# EAGLE design Shakey (EAGLE 6.5.0)
AUTHOR: Little Bird Electronics; PRODUCT_NAME: Shakey; REV: 1.1
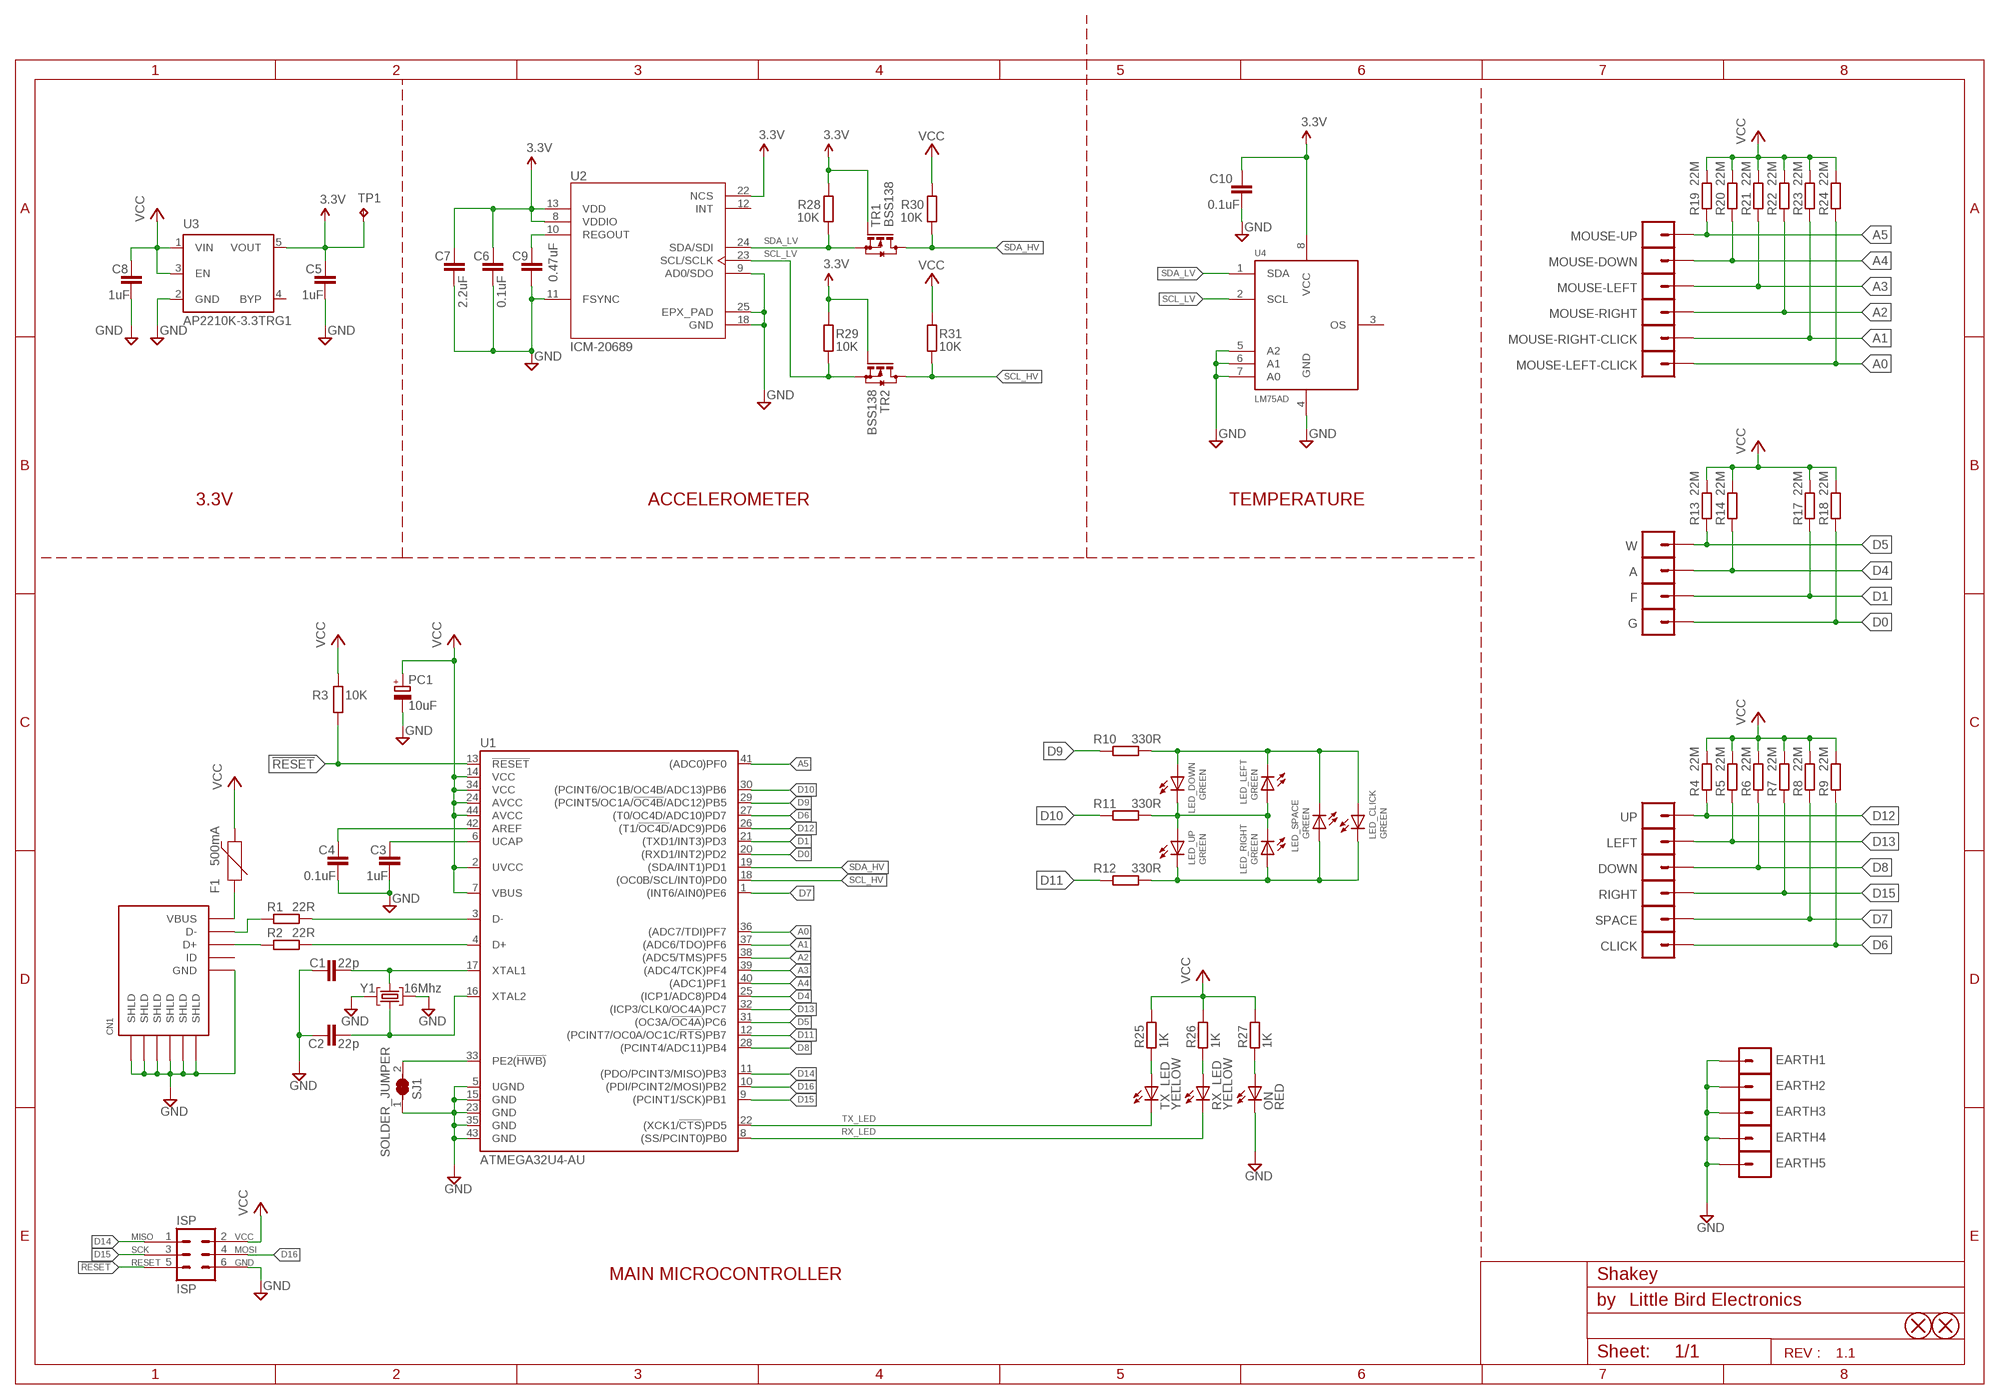
[diagram p0: schematic, sheet 1]

## Parts
A  MA01-1-ALLIGATOR-3.0MM  [MA01-1-ALLIGATOR-3.0MM]
C1  22p  C-EUC0603  [C0603]
C2  22p  C-EUC0603  [C0603]
C3  1uF  C-EUC0603  [C0603]
C4  0.1uF  C-EUC0603  [C0603]
C5  1uF  C-EUC0603  [C0603]
C6  0.1uF  C-EUC0603  [C0603]
C7  2.2uF  C-EUC0603  [C0603]
C8  1uF  C-EUC0603  [C0603]
C9  0.47uF  C-EUC0603  [C0603]
C10  0.1uF  C-EUC0603  [C0603]
CLICK  MA01-1-ALLIGATOR-3.0MM  [MA01-1-ALLIGATOR-3.0MM]
CN1  MicroUSB  CONN_USB-4UCON-11071  [4UCON-11071]
DOWN  MA01-1-ALLIGATOR-3.0MM  [MA01-1-ALLIGATOR-3.0MM]
EARTH1  MA01-1-ALLIGATOR-3.0MM  [MA01-1-ALLIGATOR-3.0MM]
EARTH2  MA01-1-ALLIGATOR-3.0MM  [MA01-1-ALLIGATOR-3.0MM]
EARTH3  MA01-1-ALLIGATOR-3.0MM  [MA01-1-ALLIGATOR-3.0MM]
EARTH4  MA01-1-ALLIGATOR-3.0MM  [MA01-1-ALLIGATOR-3.0MM]
EARTH5  MA01-1-ALLIGATOR-3.0MM  [MA01-1-ALLIGATOR-3.0MM]
F  MA01-1-ALLIGATOR-3.0MM  [MA01-1-ALLIGATOR-3.0MM]
F1  500mA  PPTC-1206  [PPC-1206]
G  MA01-1-ALLIGATOR-3.0MM  [MA01-1-ALLIGATOR-3.0MM]
ISP  ISP  DEBUGPORT-6PIN-ISP-AVR  [MA03-2]
JP1  FIDUCIAL-1X3MM  [FIDUCIAL-1X3MM]
JP2  FIDUCIAL-1X3MM  [FIDUCIAL-1X3MM]
LED_CLICK  GREEN  LED-1206-LTST-BOTTOM  [LED-1206-LTST-BOTTOM]
LED_DOWN  GREEN  LED-1206-LTST-BOTTOM  [LED-1206-LTST-BOTTOM]
LED_LEFT  GREEN  LED-1206-LTST-BOTTOM  [LED-1206-LTST-BOTTOM]
LED_RIGHT  GREEN  LED-1206-LTST-BOTTOM  [LED-1206-LTST-BOTTOM]
LED_SPACE  GREEN  LED-1206-LTST-BOTTOM  [LED-1206-LTST-BOTTOM]
LED_UP  GREEN  LED-1206-LTST-BOTTOM  [LED-1206-LTST-BOTTOM]
LEFT  MA01-1-ALLIGATOR-3.0MM  [MA01-1-ALLIGATOR-3.0MM]
MOUSE-DOWN  MA01-1-ALLIGATOR-3.0MM  [MA01-1-ALLIGATOR-3.0MM]
MOUSE-LEFT  MA01-1-ALLIGATOR-3.0MM  [MA01-1-ALLIGATOR-3.0MM]
MOUSE-LEFT-CLICK  MA01-1-ALLIGATOR-3.0MM  [MA01-1-ALLIGATOR-3.0MM]
MOUSE-RIGHT  MA01-1-ALLIGATOR-3.0MM  [MA01-1-ALLIGATOR-3.0MM]
MOUSE-RIGHT-CLICK  MA01-1-ALLIGATOR-3.0MM  [MA01-1-ALLIGATOR-3.0MM]
MOUSE-UP  MA01-1-ALLIGATOR-3.0MM  [MA01-1-ALLIGATOR-3.0MM]
ON  RED  LED-1206-LTST-BOTTOM  [LED-1206-LTST-BOTTOM]
PC1  10uF  CAP_POL-CT6032  [CT6032]
R1  22R  R-EU_R0603  [R0603]
R2  22R  R-EU_R0603  [R0603]
R3  10K  R-EU_R0603  [R0603]
R4  22M  R-EU_R0603  [R0603]
R5  22M  R-EU_R0603  [R0603]
R6  22M  R-EU_R0603  [R0603]
R7  22M  R-EU_R0603  [R0603]
R8  22M  R-EU_R0603  [R0603]
R9  22M  R-EU_R0603  [R0603]
R10  330R  R-EU_R0603  [R0603]
R11  330R  R-EU_R0603  [R0603]
R12  330R  R-EU_R0603  [R0603]
R13  22M  R-EU_R0603  [R0603]
R14  22M  R-EU_R0603  [R0603]
R17  22M  R-EU_R0603  [R0603]
R18  22M  R-EU_R0603  [R0603]
R19  22M  R-EU_R0603  [R0603]
R20  22M  R-EU_R0603  [R0603]
R21  22M  R-EU_R0603  [R0603]
R22  22M  R-EU_R0603  [R0603]
R23  22M  R-EU_R0603  [R0603]
R24  22M  R-EU_R0603  [R0603]
R25  1K  R-EU_R0603  [R0603]
R26  1K  R-EU_R0603  [R0603]
R27  1K  R-EU_R0603  [R0603]
R28  10K  R-EU_R0603  [R0603]
R29  10K  R-EU_R0603  [R0603]
R30  10K  R-EU_R0603  [R0603]
R31  10K  R-EU_R0603  [R0603]
RIGHT  MA01-1-ALLIGATOR-3.0MM  [MA01-1-ALLIGATOR-3.0MM]
RX_LED  YELLOW  LED-1206-LTST-BOTTOM  [LED-1206-LTST-BOTTOM]
SJ1  SOLDER_JUMPER  SOLDER_JUMPER_NC  [SOLDER_JUMPER_NC]
SPACE  MA01-1-ALLIGATOR-3.0MM  [MA01-1-ALLIGATOR-3.0MM]
TP1  TESTPAD  TESTPAD-2.54MM  [TP-2.54MM]
TR1  BSS138  MOSFET-N-BSS138  [SOT23]
TR2  BSS138  MOSFET-N-BSS138  [SOT23]
TX_LED  YELLOW  LED-1206-LTST-BOTTOM  [LED-1206-LTST-BOTTOM]
U1  ATMEGA32U4-AU  [TQFP44]
U2  ICM-20689  [QFN-24-4X4-0.9MM]
U3  AP2210K-3.3TRG1  [SOT23-5]
U4  LM75AD  [SOT96-1]
UP  MA01-1-ALLIGATOR-3.0MM  [MA01-1-ALLIGATOR-3.0MM]
W  MA01-1-ALLIGATOR-3.0MM  [MA01-1-ALLIGATOR-3.0MM]
Y1  16Mhz  CRYSTAL_GROUNDED_2GND-FA-238  [FA-238]

## Nets
3.3V: C5.2 C6.2 C7.2 C10.2 R28.2 R29.2 TP1.TP TR1.1(G) TR2.1(G) U2.8(VDDIO) U2.13(VDD) U2.22(NCS) U3.5(VOUT) U4.8(VCC)
!RESET!: ISP.5 R3.1 U1.13(!RESET)
A0: MOUSE-LEFT-CLICK.1@0 MOUSE-LEFT-CLICK.1@1 R24.1 U1.36((ADC7/TDI)PF7)
A1: MOUSE-RIGHT-CLICK.1@0 MOUSE-RIGHT-CLICK.1@1 R23.1 U1.37((ADC6/TDO)PF6)
A2: MOUSE-RIGHT.1@0 MOUSE-RIGHT.1@1 R22.1 U1.38((ADC5/TMS)PF5)
A3: MOUSE-LEFT.1@0 MOUSE-LEFT.1@1 R21.1 U1.39((ADC4/TCK)PF4)
A4: MOUSE-DOWN.1@0 MOUSE-DOWN.1@1 R20.1 U1.40((ADC1)PF1)
A5: MOUSE-UP.1@0 MOUSE-UP.1@1 R19.1 U1.41((ADC0)PF0)
D0: G.1@0 G.1@1 R18.1 U1.20((RXD1/INT2)PD2)
D1: F.1@0 F.1@1 R17.1 U1.21((TXD1/INT3)PD3)
D4: A.1@0 A.1@1 R14.1 U1.25((ICP1/ADC8)PD4)
D5: R13.1 U1.31((OC3A/!OC4A!)PC6) W.1@0 W.1@1
D6: CLICK.1@0 CLICK.1@1 R9.1 U1.27((T0/OC4D/ADC10)PD7)
D7: R8.1 SPACE.1@0 SPACE.1@1 U1.1((INT6/AIN0)PE6)
D8: DOWN.1@0 DOWN.1@1 R6.1 U1.28((PCINT4/ADC11)PB4)
D9: R10.1 U1.29((PCINT5/OC1A/!OC4B!/ADC12)PB5)
D10: R11.1 U1.30((PCINT6/OC1B/OC4B/ADC13)PB6)
D11: R12.1 U1.12((PCINT7/OC0A/OC1C/!RTS!)PB7)
D12: R4.1 U1.26((T1/!OC4D!/ADC9)PD6) UP.1@0 UP.1@1
D13: LEFT.1@0 LEFT.1@1 R5.1 U1.32((ICP3/CLK0/OC4A)PC7)
D14: ISP.1 U1.11((PDO/PCINT3/MISO)PB3)
D15: ISP.3 R7.1 RIGHT.1@0 RIGHT.1@1 U1.9((PCINT1/SCK)PB1)
D16: ISP.4 U1.10((PDI/PCINT2/MOSI)PB2)
GND: C1.1 C2.1 C3.1 C4.1 C5.1 C6.1 C7.1 C8.1 C9.1 C10.1 CN1.GND CN1.SHLD@1(SHLD) CN1.SHLD@2(SHLD) CN1.SHLD@3(SHLD) CN1.SHLD@4(SHLD) CN1.SHLD@5(SHLD) CN1.SHLD@6(SHLD) EARTH1.1@0 EARTH1.1@1 EARTH2.1@0 EARTH2.1@1 EARTH3.1@0 EARTH3.1@1 EARTH4.1@0 EARTH4.1@1 EARTH5.1@0 EARTH5.1@1 ISP.6 ON.C PC1.- SJ1.1 U1.5(UGND) U1.15(GND) U1.23(GND) U1.35(GND) U1.43(GND) U2.9(AD0/SDO) U2.11(FSYNC) U2.18(GND) U2.25(EPX_PAD) U3.2(GND) U4.4(GND) U4.5(A2) U4.6(A1) U4.7(A0) Y1.2 Y1.4
HWB: SJ1.2 U1.33(PE2(!HWB))
N$1: C4.2 U1.42(AREF)
N$2: C1.2 U1.17(XTAL1) Y1.1
N$3: C2.2 U1.16(XTAL2) Y1.3
N$4: LED_CLICK.A LED_DOWN.A LED_LEFT.C LED_SPACE.C R10.2
N$5: CN1.VBUS F1.1
N$6: C3.2 U1.6(UCAP)
N$7: CN1.D- R1.1
N$8: R1.2 U1.3(D-)
N$9: R2.2 U1.4(D+)
N$10: CN1.D+ R2.1
N$11: LED_CLICK.C LED_RIGHT.A LED_SPACE.A LED_UP.C R12.2
N$12: LED_DOWN.C LED_LEFT.A LED_RIGHT.C LED_UP.A R11.2
N$13: C9.2 U2.10(REGOUT)
N$17: R25.1 TX_LED.A
N$18: R26.1 RX_LED.A
N$19: ON.A R27.1
RX_LED: RX_LED.C U1.8((SS/PCINT0)PB0)
SCL_HV: R31.1 TR2.3(D) U1.18((OC0B/SCL/INT0)PD0)
SCL_LV: R29.1 TR2.2(S) U2.23(SCL/SCLK) U4.2(SCL)
SDA_HV: R30.1 TR1.3(D) U1.19((SDA/INT1)PD1)
SDA_LV: R28.1 TR1.2(S) U2.24(SDA/SDI) U4.1(SDA)
TX_LED: TX_LED.C U1.22((XCK1/!CTS!)PD5)
VCC: C8.2 F1.2 ISP.2 PC1.+ R3.2 R4.2 R5.2 R6.2 R7.2 R8.2 R9.2 R13.2 R14.2 R17.2 R18.2 R19.2 R20.2 R21.2 R22.2 R23.2 R24.2 R25.2 R26.2 R27.2 R30.2 R31.2 U1.2(UVCC) U1.7(VBUS) U1.14(VCC) U1.24(AVCC) U1.34(VCC) U1.44(AVCC) U3.1(VIN) U3.3(EN)
Unconnected: CN1.ID U2.12(INT) U3.4(BYP) U4.3(OS)

## Notes on the sheet
- 3.3V | ACCELEROMETER | TEMPERATURE
- MAIN MICROCONTROLLER

## Library data of the parts
A CLICK DOWN EARTH1-EARTH5 F G LEFT MOUSE-DOWN MOUSE-LEFT MOUSE-LEFT-CLICK MOUSE-RIGHT MOUSE-RIGHT-CLICK MOUSE-UP RIGHT SPACE UP W = SixthLogic:MA01-1-ALLIGATOR: 2x Holes for Alligator Clips; DESCRIPTION: 2x3mm Holes for Alligator Clips
C1 C2 = rcl:C-EU: CAPACITOR, European symbol; DESCRIPTION: CAP CER 22PF 16V C0G/NP0 0603; MF: KEMET; MPN: C0603C220K4GACTU; OC_DIGIKEY: 399-9031-2-ND; SUPPLIER: Digikey; UNITPRICE: $0.01675; URL: https://www.digikey.com/product-detail/en/kemet/C0603C220K4GACTU/399-9031-2-ND/2200194
C3 C5 C8 = rcl:C-EU: CAPACITOR, European symbol; DESCRIPTION: CAP CER 1UF 25V X5R 0603; MF: Samsung Electro-Mechanics; MPN: CL10A105KA8NNNC; OC_DIGIKEY: 1276-1102-2-ND; SUPPLIER: Digikey; UNITPRICE: $0.00785; URL: https://www.digikey.com/product-detail/en/samsung-electro-mechanics/CL10A105KA8NNNC/1276-1102-2-ND/3886760
C4 C6 C10 = rcl:C-EU: CAPACITOR, European symbol; DESCRIPTION: CAP CER 0.1UF 50V X7R 0603; MF: Samsung Electro-Mechanics; MPN: CL10B104KB8NNNC; OC_DIGIKEY: 1276-1000-2-ND; SUPPLIER: Digikey; UNITPRICE: $0.00652; URL: https://www.digikey.com/product-detail/en/samsung-electro-mechanics/CL10B104KB8NNNC/1276-1000-2-ND/3886658
C7 = rcl:C-EU: CAPACITOR, European symbol; DESCRIPTION: CAP CER 2.2UF 16V X5R 0603; MF: Samsung Electro-Mechanics; MPN: CL10A225KO8NNNC; OC_DIGIKEY: 1276-1040-2-ND; SUPPLIER: Digikey; UNITPRICE: $0.01863; URL: https://www.digikey.com/product-detail/en/samsung-electro-mechanics/CL10A225KO8NNNC/1276-1040-2-ND/3886698
C9 = rcl:C-EU: CAPACITOR, European symbol; DESCRIPTION: CAP CER 0.47UF 16V X7R 0603; MF: Murata Electronics North America; MPN: GCM188R71C474KA55D; OC_DIGIKEY: 490-4775-2-ND; SUPPLIER: Digikey; UNITPRICE: $0.03744; URL: https://www.digikey.com/product-detail/en/murata-electronics-north-america/GCM188R71C474KA55D/490-4775-2-ND/1641649
CN1 = SixthLogic:CONN_USB: USB Connector; DESCRIPTION: B TYPE FEMALE 05P SMT 90° WITHOUT POST 2 SHELL TABS; MF: 4UCON; MPN: 11071; URL: http://www.4uconnector.com/online/Itemadrawing.asp?fldseries=11071&seriesno_a=1006
F1 = SixthLogic:PPTC; DESCRIPTION: PTC RESET FUSE 8V 500MA 1206; MF: Bel Fuse Inc.; MPN: 0ZCJ0050FF2G; OC_DIGIKEY: 507-1802-6-ND; SUPPLIER: Digikey; UNITPRICE: $0.07588; URL: https://www.digikey.com/product-detail/en/bel-fuse-inc/0ZCJ0050FF2G/507-1802-6-ND/4156237
ISP = SixthLogic:DEBUGPORT-6PIN; DESCRIPTION: 6 Pin ISP port
JP1 JP2 = SixthLogic:FIDUCIAL
LED_CLICK LED_DOWN LED_LEFT LED_RIGHT LED_SPACE LED_UP = SixthLogic:LED; DESCRIPTION: LED GREEN CLEAR CHIP SMD; MF: Lite-On Inc.; MPN: LTST-C230KGKT; OC_DIGIKEY: 160-1456-2-ND; SUPPLIER: Digikey; UNITPRICE: $0.05693; URL: https://www.digikey.com/product-detail/en/lite-on-inc/LTST-C230KGKT/160-1456-2-ND/386855
ON = SixthLogic:LED; DESCRIPTION: LED RED CLEAR CHIP SMD; MF: Lite-On Inc.; MPN: LTST-C230KRKT; OC_DIGIKEY: 160-1457-2-ND; SUPPLIER: Digikey; UNITPRICE: $0.05668; URL: https://www.digikey.com/product-detail/en/lite-on-inc/LTST-C230KRKT/160-1457-2-ND/386857
PC1 = SixthLogic:CAP_POL: Capacitor with Polarity; DESCRIPTION: CAP TANT 10UF 20V 10% 2312; MF: KEMET; MPN: T491C106K020AT7280; OC_DIGIKEY: 399-10158-2-ND; SUPPLIER: Digikey; UNITPRICE: $0.15113; URL: https://www.digikey.com/product-detail/en/kemet/T491C106K020AT7280/399-10158-2-ND/3759637
R1 R2 = rcl:R-EU_: RESISTOR, European symbol; DESCRIPTION: RES 22 OHM 5% 1/10W 0603; MF: Stackpole Electronics Inc.; MPN: RMCF0603JT22R0; OC_DIGIKEY: RMCF0603JT22R0TR-ND; SUPPLIER: Digikey; UNITPRICE: $0.00196; URL: https://www.digikey.com/product-detail/en/stackpole-electronics-inc/RMCF0603JT22R0/RMCF0603JT22R0TR-ND/1758012
R3 R28-R31 = rcl:R-EU_: RESISTOR, European symbol; DESCRIPTION: RES 10K OHM 5% 1/10W 0603; MF: Stackpole Electronics Inc.; MPN: RMCF0603JG10K0; OC_DIGIKEY: RMCF0603JG10K0TR-ND; SUPPLIER: Digikey; UNITPRICE: $0.00170; URL: https://www.digikey.com/product-detail/en/stackpole-electronics-inc/RMCF0603JG10K0/RMCF0603JG10K0TR-ND/1712133
R4-R9 R13 R14 R17-R24 = rcl:R-EU_: RESISTOR, European symbol; DESCRIPTION: RES SMD 22M OHM 10% 1/10W 0603; MF: Panasonic Electronic Components; MPN: ERJ-3GEYK226V; OC_DIGIKEY: P22MGTR-ND; SUPPLIER: Digikey; UNITPRICE: $0.00335; URL: https://www.digikey.com/product-detail/en/panasonic-electronic-components/ERJ-3GEYK226V/P22MGTR-ND/282153
R10-R12 = rcl:R-EU_: RESISTOR, European symbol; DESCRIPTION: RES 330 OHM 5% 1/10W 0603; MF: Stackpole Electronics Inc.; MPN: RMCF0603JT330R; OC_DIGIKEY: RMCF0603JT330RTR-ND; SUPPLIER: Digikey; UNITPRICE: $0.00196; URL: https://www.digikey.com/product-detail/en/stackpole-electronics-inc/RMCF0603JT330R/RMCF0603JT330RTR-ND/1757998
R25-R27 = rcl:R-EU_: RESISTOR, European symbol; DESCRIPTION: RES SMD 1K OHM 5% 1/10W 0603; MF: Yageo; MPN: RC0603JR-071KL; OC_DIGIKEY: 311-1.0KGRTR-ND; SUPPLIER: Digikey; UNITPRICE: $0.00268; URL: https://www.digikey.com/product-detail/en/yageo/RC0603JR-071KL/311-1.0KGRTR-ND/726677
RX_LED TX_LED = SixthLogic:LED; DESCRIPTION: LED YELLOW CLEAR CHIP SMD; MF: Lite-On Inc.; MPN: LTST-C230KSKT; OC_DIGIKEY: 160-1458-2-ND; SUPPLIER: Digikey; UNITPRICE: $0.05595; URL: https://www.digikey.com/product-detail/en/lite-on-inc/LTST-C230KSKT/160-1458-2-ND/386859
SJ1 = SixthLogic:SOLDER_JUMPER_NC: Solder Jumper - Normally Closed; DESCRIPTION: Solder Jumper - Normally Closed
TP1 = SixthLogic:TESTPAD
TR1 TR2 = SixthLogic:MOSFET-N; DESCRIPTION: MOSFET N-CH 50V 220MA SOT-23; MF: ON Semiconductor; MPN: BSS138; OC_DIGIKEY: BSS138TR-ND; SUPPLIER: Digikey; UNITPRICE: $0.05419; URL: https://www.digikey.com/product-detail/en/on-semiconductor/BSS138/BSS138TR-ND/244210
U1 = SixthLogic:ATMEGA32U4: Atmel ATmega32u4 MCU, 32KByte Atmel 44-pin 8-bit Microcontroller with 32KBytes of ISP Flash and USB Controller; DESCRIPTION: IC MCU 8BIT 32KB FLASH; MF: Microchip Technology; MPN: ATMEGA32U4-AU; OC_DIGIKEY: ATMEGA32U4-AU-ND; UNITPRICE: $3.04; URL: https://www.digikey.com/product-detail/en/microchip-technology/ATMEGA32U4-AU/ATMEGA32U4-AU-ND/1914602
U2 = SixthLogic:ICM-20689: High Performance 6-Axis MEMS MotionTracking™ Device in 4x4 mm Package The ICM-20689 is a 6-axis MotionTracking device that combines a 3-axis gyroscope, 3-axis accelerometer, and a Digital Motion Processor™ (DMP) in a small 4x4x0.9 mm (24-pin QFN) package.; DESCRIPTION: IMU ACCEL/GYRO/TEMP I2C/SPI QFN; MF: TDK InvenSense; MPN: ICM-20689; OC_DIGIKEY: 1428-1059-2-ND; SUPPLIER: Digikey; UNITPRICE: $2.62548; URL: https://www.digikey.com/product-detail/en/tdk-invensense/ICM-20689/1428-1059-2-ND/5872869
U3 = SixthLogic:AP2210K: The AP2210 is a 300mA ULDO regulator which provides very low noise, ultra low dropout voltage (typically 250mV at 300mA), very low standby current (1μA maximum) and excellent power supply ripple rejection (PSRR 75dB at 100Hz) in battery powered applications, such as handsets, PDAs and in noise sensitive applications, such as RF electronics.; DESCRIPTION: IC REG LDO 3.3V 0.3A SOT23-5; MF: Diodes Inc; MPN: AP2210K-3.3TRG1; OC_DIGIKEY: AP2210K-3.3TRG1DITR-ND; UNITPRICE: $0.10797; URL: https://www.digikey.com/product-detail/en/diodes-incorporated/AP2210K-3.3TRG1/AP2210K-3.3TRG1DITR-ND/4470819
U4 = SixthLogic:LM75: LM75 Digital temperature sensor and thermal watchdog; DESCRIPTION: SENSOR DIGITAL -55C-125C 8SO; MF: NXP USA Inc.; MPN: LM75AD,118; OC_DIGIKEY: 568-10295-2-ND; SUPPLIER: Digikey; UNITPRICE: $0.28743; URL: https://www.digikey.com/product-detail/en/nxp-usa-inc/LM75AD118/568-10295-2-ND/1692795
Y1 = SixthLogic:CRYSTAL_GROUNDED_2GND: 4 PIN SMD Crystal; DESCRIPTION: CRYSTAL 16.0000MHZ 18PF SMD; MF: EPSON; MPN: FA-238 16.0000MB-C3; OC_DIGIKEY: SER3686TR-ND; SUPPLIER: Digikey; UNITPRICE: $0.22880; URL: https://www.digikey.com/product-detail/en/epson/FA-238-16.0000MB-C3/SER3686TR-ND/2403378

## Board
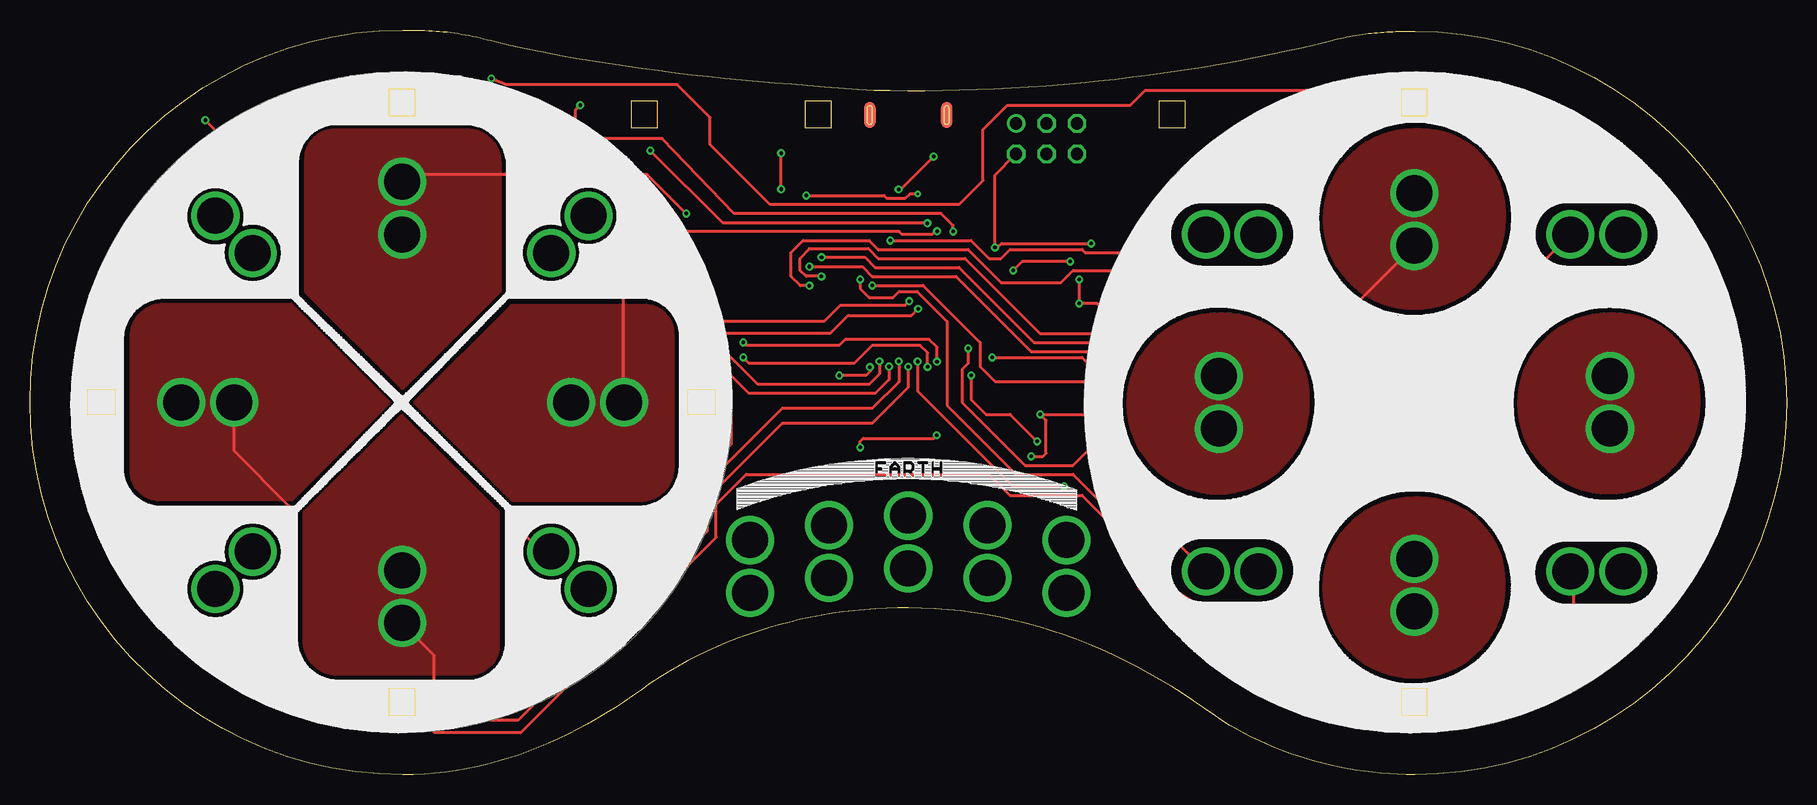
[diagram p1: board, top side]
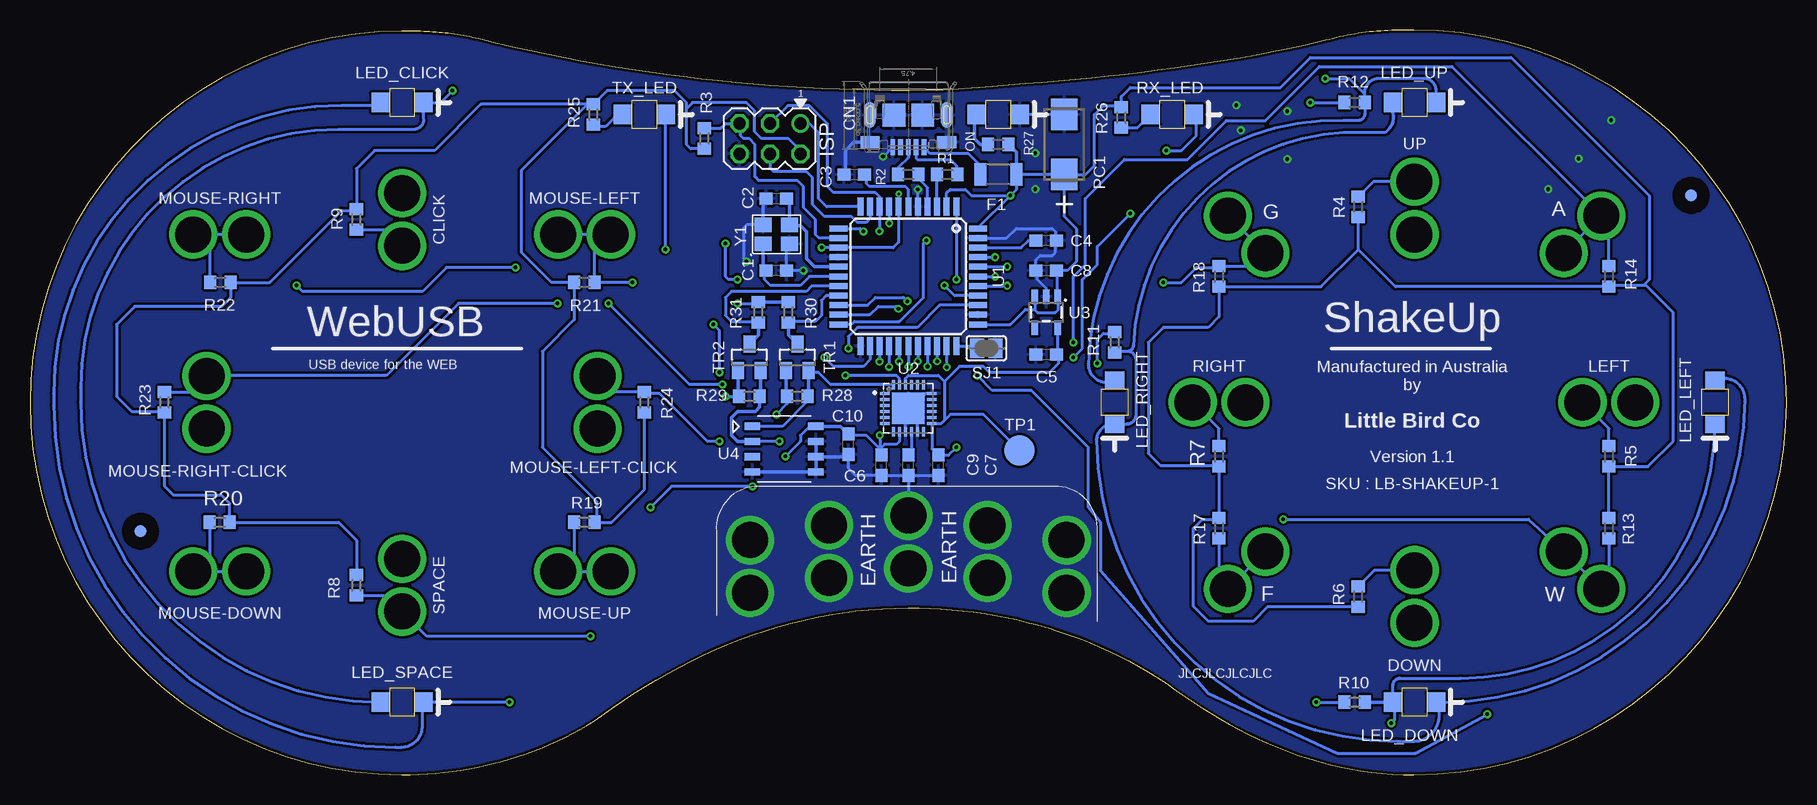
[diagram p2: board, bottom side, seen from below]

Size 146.42 x 62.1 mm. Coordinates in mm from the lower left corner, seen from the top.
Outline: 300 segments
Copper layers (1*16): Top 0.035mm / dielectric 1.5mm / Bottom 0.035mm
Design rules "LBE": minimum track width 7mil, minimum drill 0.2mm, track to track 8mil, track to pad 8mil, pad to pad 8mil, via to via 8mil, smd to smd 8mil, copper to edge 7mil, drill to drill 7mil, minimum pad ring 7mil, minimum via ring 7mil, stop-mask expansion 4mil, vias tented up to drill 25mil, thermal gap 10mil

### Footprints (pad centres in the part's own frame; a part is rotated, then mirrored left to right if it is on the bottom)
MA01-1-ALLIGATOR-3.0MM = drill 3: 1@0 -2.2,0; 1@1 2.2,0
C0603 = smd 1.1 x 1: 1 -0.85,0; 2 0.85,0
4UCON-11071 = smd 0.4 x 1.35: D+ 0,4.125; D- -0.65,4.125; GND 1.3,4.125; ID 0.65,4.125; VBUS -1.3,4.125 | smd 1.9 x 1.9: SHLD@1 -1.2,1.45; SHLD@2 1.2,1.45 | smd 1.6 x 1: SHLD@3 -3.2,3.7; SHLD@4 3.2,3.7 | smd 0.9 x 2.15: SHLD@5 -3.2,1.45; SHLD@6 3.2,1.45 | smd 0.9 x 2.15 bottom: SHLD@7 -3.2,1.45; SHLD@8 3.2,1.45
PPC-1206 = smd 1 x 1.9: 1 -1.5,0; 2 1.5,0
MA03-2 = drill 1.016: 1 -2.54,-1.27 | drill 1.016 octagon: 2 -2.54,1.27; 3 0,-1.27; 4 0,1.27; 5 2.54,-1.27; 6 2.54,1.27
FIDUCIAL-1X3MM = smd 1 x 1: 1 0,0
LED-1206-LTST-BOTTOM = smd 1.6 x 1.5: A 0,-1.805; C 0,1.805
CT6032 = smd 2.2 x 2.6: + 0,-2.5; - 0,2.5
R0603 = smd 1 x 1.1: 1 -0.85,0; 2 0.85,0
SOLDER_JUMPER_NC = smd 1.168 x 1.6: 1 -0.762,0; 2 0.762,0
TP-2.54MM = smd 2.54 x 2.54: TP 0,0
SOT23 = smd 1 x 1.4: 1 -0.95,-1.1; 2 0.95,-1.1; 3 0,1.1
TQFP44 = smd 1.5 x 0.5: 1 -5.8,4; 2 -5.8,3.2; 3 -5.8,2.4; 4 -5.8,1.6; 5 -5.8,0.8; 6 -5.8,0; 7 -5.8,-0.8; 8 -5.8,-1.6; 9 -5.8,-2.4; 10 -5.8,-3.2; 11 -5.8,-4; 23 5.8,-4; 24 5.8,-3.2; 25 5.8,-2.4; 26 5.8,-1.6; 27 5.8,-0.8; 28 5.8,0; 29 5.8,0.8; 30 5.8,1.6; 31 5.8,2.4; 32 5.8,3.2; 33 5.8,4 | smd 0.5 x 1.5: 12 -4,-5.8; 13 -3.2,-5.8; 14 -2.4,-5.8; 15 -1.6,-5.8; 16 -0.8,-5.8; 17 0,-5.8; 18 0.8,-5.8; 19 1.6,-5.8; 20 2.4,-5.8; 21 3.2,-5.8; 22 4,-5.8; 34 4,5.8; 35 3.2,5.8; 36 2.4,5.8; 37 1.6,5.8; 38 0.8,5.8; 39 0,5.8; 40 -0.8,5.8; 41 -1.6,5.8; 42 -2.4,5.8; 43 -3.2,5.8; 44 -4,5.8
QFN-24-4X4-0.9MM = smd 0.79 x 0.26: 1 -1.97,1.25; 2 -1.97,0.75; 3 -1.97,0.25; 4 -1.97,-0.25; 5 -1.97,-0.75; 6 -1.97,-1.25; 13 1.97,-1.25; 14 1.97,-0.75; 15 1.97,-0.25; 16 1.97,0.25; 17 1.97,0.75; 18 1.97,1.25 | smd 0.26 x 0.79: 7 -1.25,-1.97; 8 -0.75,-1.97; 9 -0.25,-1.97; 10 0.25,-1.97; 11 0.75,-1.97; 12 1.25,-1.97; 19 1.25,1.97; 20 0.75,1.97; 21 0.25,1.97; 22 -0.25,1.97; 23 -0.75,1.97; 24 -1.25,1.97 | smd 2.7 x 2.6: 25 0,0
SOT23-5 = smd 0.55 x 1.2: 1 -0.95,-1.3; 2 0,-1.3; 3 0.95,-1.3; 4 0.95,1.3; 5 -0.95,1.3
SOT96-1 = smd 1.3 x 0.6: 1 0,0; 2 0,-1.27; 3 0,-2.54; 4 0,-3.81; 5 5.3,-3.81; 6 5.3,-2.54; 7 5.3,-1.27; 8 5.3,0
FA-238 = smd 1.4 x 1.2: 1 -1.1,-0.8; 2 1.1,-0.8; 3 1.1,0.8; 4 -1.1,0.8

### Placement (x,y rotation side)
A  17.01,45.05 225 bottom
C1  84.21,42.05 180 bottom
C2  84.21,48.05 0 bottom
C3  77.71,50.05 0 bottom
C4  61.71,44.55 180 bottom
C5  61.71,35.05 0 bottom
C6  75.46,25.8 90 bottom
C7  70.71,25.8 90 bottom
C8  61.71,42.05 0 bottom
C9  73.21,25.8 90 bottom
C10  78.21,27.55 90 bottom
CLICK  115.41,46.3 270 bottom
CN1  73.21,56.45 180 bottom
DOWN  31.01,14.85 90 bottom
EARTH1  66.61,18.6 270 bottom
EARTH2  86.41,17.36 270 bottom
EARTH3  79.81,18.6 270 bottom
EARTH4  73.21,19.4 270 bottom
EARTH5  60.01,17.36 270 bottom
F  45.01,17.05 225 bottom
F1  65.71,50.05 0 bottom
G  45.01,45.05 315 bottom
ISP  84.74,53.04 180 bottom
JP1  7.96,48.3 0 bottom
JP2  137.21,20.3 90 bottom
LED_CLICK  115.41,56.05 270 bottom
LED_DOWN  31.01,6.05 270 bottom
LED_LEFT  5.96,31.05 180 bottom
LED_RIGHT  56.01,31.05 180 bottom
LED_SPACE  115.41,6.05 270 bottom
LED_UP  31.01,56.05 270 bottom
LEFT  14.81,31.05 0 bottom
MOUSE-DOWN  130.61,16.95 0 bottom
MOUSE-LEFT  100.21,45.05 180 bottom
MOUSE-LEFT-CLICK  99.11,31.05 270 bottom
MOUSE-RIGHT  130.61,45.05 0 bottom
MOUSE-RIGHT-CLICK  131.71,31.05 270 bottom
MOUSE-UP  100.21,16.95 0 bottom
ON  65.71,55.05 270 bottom
PC1  60.21,52.55 0 bottom
R1  69.96,50.05 180 bottom
R2  73.21,50.05 0 bottom
R3  90.21,53.05 270 bottom
R4  35.71,47.35 270 bottom
R5  14.81,26.55 270 bottom
R6  35.71,14.85 270 bottom
R7  47.31,26.55 270 bottom
R8  119.21,15.8 90 bottom
R9  119.21,46.3 90 bottom
R10  36.01,6.05 0 bottom
R11  56.01,36.05 270 bottom
R12  36.01,56.05 0 bottom
R13  14.81,20.55 90 bottom
R14  14.81,41.55 270 bottom
R17  47.31,20.55 90 bottom
R18  47.31,41.55 270 bottom
R19  100.21,21.05 0 bottom
R20  130.61,21.05 0 bottom
R21  100.21,41.05 180 bottom
R22  130.56,41.05 0 bottom
R23  135.21,31.05 270 bottom
R24  95.21,31.05 270 bottom
R25  99.46,55.05 90 bottom
R26  55.46,54.8 90 bottom
R27  65.71,52.55 0 bottom
R28  82.46,31.55 180 bottom
R29  86.46,31.55 180 bottom
R30  83.21,38.55 90 bottom
R31  85.71,38.55 90 bottom
RIGHT  47.31,31.05 180 bottom
RX_LED  51.21,55.05 270 bottom
SJ1  66.71,35.55 180 bottom
SPACE  115.41,15.8 270 bottom
TP1  63.96,27.05 0 bottom
TR1  82.46,34.8 0 bottom
TR2  86.46,34.8 0 bottom
TX_LED  95.21,55.05 270 bottom
U1  73.21,41.55 270 bottom
U2  73.21,30.55 0 bottom
U3  61.71,38.55 180 bottom
U4  86.21,29.05 0 bottom
UP  31.01,47.25 90 bottom
W  17.01,17.05 315 bottom
Y1  84.21,45.05 0 bottom

### Tracks (layer width: path | path; a pad name or v marks a point on that pad's centre or on a via)
3.3V  (via drill 0.3)
  Top 0.254: v88.46,31.55 88.71,31.3 88.71,30.55 88.21,30.05 v84.21,30.05 84.71,29.55 84.71,26.8 84.46,26.55 v83.46,26.55 | v69.21,27.3 69.21,27.8 69.46,28.05 75.33,28.05 v75.59,28.31
  Bottom 0.254: U2.8 73.96,27.8 74.21,27.55 75.21,27.55 75.46,27.3 | 75.46,27.3 C6.2 | R28.2 83.31,30.95 v84.21,30.05 | v88.46,31.55 R29.2 | U4.8 81.46,29.05 82.21,28.3 82.21,27.8 v83.46,26.55 | 75.46,27.3 75.71,27.3 | 75.71,27.3 76.71,28.3 78.11,28.3 C10.2 | U3.5 60.76,35.15 C5.2 60.71,34.9 60.71,34.3 61.46,33.55 66.46,33.55 66.96,34.05 68.96,34.05 70.21,32.8 | U2.22 73.46,33.05 73.21,33.3 70.71,33.3 70.21,32.8 | 70.21,32.8 70.21,29.55 70.33,29.43 | 70.33,29.43 70.46,29.3 U2.13 71.24,27.18 C7.2 69.86,26.65 v69.21,27.3 | v75.59,28.31 75.59,27.42 75.71,27.3 | TP1.TP 66.96,30.05 69.71,30.05 70.33,29.43
  Bottom 0.305: U4.8 78.86,29.05 C10.2 | TR1.1 83.41,31.65 R28.2 | TR2.1 87.41,31.65 R29.2
!RESET!
  Bottom 0.254: R3.1 88.86,53.9 88.46,54.3 ISP.5 87.21,54.24 87.21,53.3 86.96,53.05 86.46,53.05 86,52.55 86,49.85 85.71,49.55 82.46,49.55 81.96,49.05 81.96,47.3 80.96,46.3 80.96,45.05 80.66,44.75 U1.13
A0  (via drill 0.3)
  Top 0.254: v78.21,35.55 78.21,34.3 77.71,33.8 77.71,31.05 82.96,25.8 86.96,25.8 v88.96,27.8
  Bottom 0.254: MOUSE-LEFT-CLICK.1@0 97.76,31.9 R24.1 95.11,31.8 93.96,31.8 89.96,27.8 v88.96,27.8 | U1.36 70.61,39.15 72.46,37.3 77.46,37.3 78.21,36.55 v78.21,35.55
  pour Top: 91.54,30.94 arc-90 99.04,38.44 99.54,38.44 arc-90 106.54,31.44 106.54,30.94 arc-90 99.04,23.44 arc-90
A1  (via drill 0.3)
  Top 0.254: v70.21,40.8 74.46,40.8 79.21,36.05 79.21,34.05 80.46,32.8 88.46,32.8 v88.71,32.55 | v98.21,39.3 v102.46,39.3
  Bottom 0.254: U1.37 69.36,39.95 v70.21,40.8 | v88.71,32.55 91.46,32.55 v98.21,39.3 | R23.1 133.06,31.9 MOUSE-RIGHT-CLICK.1@0 131.66,33.3 116.71,33.3 110.71,39.3 v102.46,39.3
  pour Top: 124.11,30.96 arc-90 131.61,38.46 132.11,38.46 arc-90 139.11,31.46 139.11,30.96 arc-90 131.61,23.46 arc-90
A2  (via drill 0.3)
  Top 0.254: v64.97,40.78 64.23,40.78 63.46,41.55 63.46,43.55 64.46,44.55 69.96,44.55 70.71,43.8 78.21,43.8 80.96,41.05 85.96,41.05 86.96,42.05 105.71,42.05 v105.96,42.3 | v124.21,40.8 124.21,40.85 MOUSE-RIGHT.1@1
  Bottom 0.254: MOUSE-RIGHT.1@1 MOUSE-RIGHT.1@0 131.41,43.65 R22.1 | U1.38 65,40.75 v64.97,40.78 | v105.96,42.3 111.71,42.3 113.71,40.3 123.71,40.3 v124.21,40.8
A3  (via drill 0.3)
  Top 0.254: v65.97,41.55 v65.96,41.55 65.95,41.56 64.7,41.56 64.21,42.05 64.21,43.05 64.98,43.87 69.89,43.87 70.71,43.05 77.96,43.05 84.21,36.8 91.96,36.8 v96.21,41.05
  Bottom 0.254: MOUSE-LEFT.1@1 MOUSE-LEFT.1@0 99.36,43.7 R21.1 v96.21,41.05 | U1.39 v65.97,41.55
A4  (via drill 0.3)
  Top 0.254: v64.97,42.37 64.97,42.35 69.41,42.35 70.21,41.55 77.21,41.55 83.46,35.3 88.96,35.3 89.96,34.3 89.96,23.8 94.46,19.3 94.46,16.05 112.71,4.05 118.46,4.05 128.71,13.05 128.71,16.65 MOUSE-DOWN.1@1
  Bottom 0.254: R20.1 131.46,18.3 MOUSE-DOWN.1@0 MOUSE-DOWN.1@1 | U1.40 64.99,42.35 v64.97,42.37
A5  (via drill 0.3)
  Top 0.254: v65.98,43.15 v65.99,43.16 69.6,43.16 70.46,42.3 77.46,42.3 83.71,36.05 89.21,36.05 90.71,34.55 90.71,24.25 MOUSE-UP.1@1
  Bottom 0.254: R19.1 101.06,18.3 MOUSE-UP.1@0 MOUSE-UP.1@1 | U1.41 v65.98,43.15
D0  (via drill 0.3)
  Top 0.254: v51.96,41.05 55.21,37.8 66.21,37.8 67.57,39.16 72.96,39.16 v73.29,39.49
  Bottom 0.254: G.1@0 G.1@1 44.55,42.4 R18.1 47.41,42.3 49.21,42.3 50.46,41.05 v51.96,41.05 | U1.20 76.61,39.15 75.96,39.8 73.62,39.8 v73.29,39.49
D1  (via drill 0.3)
  Top 0.254: F.1@0 42.65,18.61 40.71,20.55 40.71,21.55 41.21,22.05 53.46,22.05 54.21,22.8 54.21,35.05 55.96,36.8 66.71,36.8 68.21,38.3 73.48,38.3 v74.03,38.85
  Bottom 0.254: R17.1 47.31,16.24 F.1@1 F.1@0 | U1.21 76.41,38.35 75.71,39.05 74.23,39.05 v74.03,38.85
D4  (via drill 0.3)
  Top 0.254: v75.61,34.44 75.61,35.65 74.96,36.3 67.96,36.3 67.46,35.8 59.71,35.8 v59.46,36.05
  Bottom 0.254: R14.1 14.81,45.96 A.1@0 | A.1@1 A.1@0 | U1.25 v75.61,34.44 | v59.46,36.05 59.46,41.55 58.46,42.55 58.46,48.05 55.21,51.3 49.96,51.3 46.71,54.55 43.46,54.55 38.96,59.05 27.9,59.05 A.1@0
D5  (via drill 0.3)
  Top 0.254: 70.81,34.56 70.8,34.57 v70.81,34.47 70.81,33.4 69.96,32.55 60.71,32.55 58.21,35.05 56.71,35.05 56.21,34.55 56.21,33.8 56.96,33.05 57.46,33.05 58.46,32.05 58.46,27.55 54.96,24.05 54.96,21.05 53.96,20.05 46.46,20.05 44.96,21.3 v41.96,21.3
  Bottom 0.254: R13.1 14.81,16.14 W.1@1 W.1@0 21.51,21.3 v41.96,21.3 | U1.31 v70.81,34.47
D6  (via drill 0.3)
  Top 0.254: v73.99,34.45 v74,34.44 74,32.01 81.96,24.05 v86.21,24.05 | v94.71,22.3 103.96,22.3 108.46,26.8 108.46,37.15 CLICK.1@1
  Bottom 0.254: R9.1 116.76,45.45 CLICK.1@1 | U1.27 73.99,35.73 v73.99,34.45 | v86.21,24.05 92.96,24.05 v94.71,22.3
  pour Top: 107.89,46.33 arc-90 115.39,53.83 115.89,53.83 arc-90 122.89,46.83 122.89,46.33 arc-90 115.39,38.83 arc-90
D7  (via drill 0.3)
  Top 0.254: v69.21,41.3 69.21,40.55 69.96,39.8 71.96,39.8 72.46,40.3 73.96,40.3 76.46,37.8 76.46,30.8 82.21,25.05 86.96,25.05 93.21,18.8 93.21,15.8 v99.71,11.55
  Bottom 0.254: R8.1 116.76,14.95 SPACE.1@1 113.36,11.55 v99.71,11.55 | SPACE.1@0 115.46,18.05 | U1.1 v69.21,41.3
  pour Top: 107.86,15.6 arc-90 115.36,23.1 115.86,23.1 arc-90 122.86,16.1 122.86,15.6 arc-90 115.36,8.1 arc-90
D8  (via drill 0.3)
  Top 0.254: v73.21,34.02 73.21,32.3 70.21,29.3 62.71,29.3 56.46,23.05 56.46,20.3 40.71,4.55 34.21,4.55 33.71,5.05 33.71,9.95 DOWN.1@0
  Bottom 0.254: DOWN.1@1 34.36,17.05 R6.1 | U1.28 v73.21,34.02
  pour Top (rank 6): 30.99,30 22.82,21.85 22.82,11.18 arc90 25.59,8.41 36.67,8.41 arc90 39.08,10.82 39.08,21.85 39.08,21.91
D9  (via drill 0.3)
  Top 0.254: 72.42,34.54 v72.42,34.47 72.42,32.76 70.21,30.55 62.71,30.55 55.71,23.55 55.71,20.8 40.96,6.05 v39.21,6.05
  Bottom 0.254: U1.29 72.41,34.56 v72.42,34.47 | v39.21,6.05 R10.1
D10  (via drill 0.3)
  Top 0.254: v71.61,34.04 71.61,32.95 70.46,31.8 59.96,31.8 v57.46,34.3
  Bottom 0.254: U1.30 v71.61,34.04 | v57.46,34.3 57.46,36.3 56.96,36.8 56.11,36.8 R11.1
D11  (via drill 0.3)
  Top 0.254: v76.96,45.29 v76.96,45.3 76.96,45.8 75.96,46.8 58.71,46.8 52.71,53.05 42.71,53.05 v39.71,56.05
  Bottom 0.254: U1.12 77.21,45.55 v76.96,45.3 | v39.71,56.05 R12.1
D12  (via drill 0.3)
  Top 0.254: v74.82,34 74.82,35.19 74.21,35.8 70.21,35.8 68.71,34.3 59.96,34.3 v59.46,34.8 | v54.71,46.8 51.46,50.05 31.61,50.05 UP.1@1
  Bottom 0.254: UP.1@1 34.46,49.45 R4.1 | U1.26 v74.81,34.01 v74.82,34 | v59.46,34.8 58.71,35.55 58.71,41.3 57.46,42.55 57.46,44.05 v54.71,46.8
  pour Top (rank 6): 31.05,32.16 39.22,40.31 39.22,50.98 arc90 36.45,53.75 25.37,53.75 arc90 22.96,51.34 22.96,40.31 22.96,40.25
D13  (via drill 0.3)
  Top 0.254: 70,33.96 v70.01,33.97 v70.01,33.98 70.01,33.6 69.71,33.3 v67.47,33.3 v67.46,33.29 | v24.96,5.05 21.71,8.3 21.71,22.3 17.01,27 LEFT.1@0
  Bottom 0.254: R5.1 14.81,28.85 LEFT.1@0 | U1.32 v70.01,33.98 | 67.44,33.3 v67.45,33.29 v67.46,33.29 66.22,32.05 62.96,32.05 58.21,27.3 58.21,22.3 57.21,21.05 57.21,17.05 48.21,6.8 37.46,1.8 30.96,1.8 v24.96,5.05
  pour Top: 29.98,31.05 21.83,39.22 11.16,39.22 arc90 8.39,36.45 8.39,25.37 arc90 10.8,22.96 21.83,22.96 21.89,22.96
D14
  Bottom 0.254: U1.11 80.01,47.35 80.71,48.05 80.71,53.55 81.46,54.3 ISP.1
  Bottom 0.305: ISP.1
D15  (via drill 0.3)
  Top 0.254: v75.62,45.32 75.62,45.35 75.51,45.35 75.21,45.05 72.71,45.05 72.46,45.3 53.96,45.3 49.46,40.8 49.46,31.1 RIGHT.1@1
  Bottom 0.254: R7.1 47.31,28.85 RIGHT.1@1 | ISP.3 83.25,55.8 81.46,55.8 79.96,54.3 79.96,49.05 79.46,48.55 75.96,48.55 75.61,48.2 U1.9 v75.62,45.32
  pour Top (rank 6): 32.04,31.04 40.19,22.87 50.86,22.87 arc90 53.63,25.64 53.63,36.72 arc90 51.22,39.13 40.19,39.13 40.13,39.13
D16
  Bottom 0.254: ISP.4 84.74,50.58 84.46,50.3 81.71,50.3 81.21,49.8 81.21,47.55 80.21,46.55 77.96,46.55 77.46,46.05 76.71,46.05 76.41,46.35 U1.10
GND  (via drill 0.3)
  Top 0.254: v72.41,48.81 72.41,48.73 72.52,48.75 v75.32,51.55 | v86.71,42.8 82.71,42.8 v81.96,42.05 | v14.62,54.58 17.33,51.87 v17.33,51.37 v19.87,48.83 | v45.87,55.83 45.5,55.46 v45.5,53.73 43.22,53.73 v41.62,55.33 39.9,57.05 38.96,57.05 38.46,56.8 38.46,55.3 41.62,52.14 v41.62,51.33 | v62.62,48.83 v62.62,51.83
  Bottom 0.254: C10.1 78.21,25.55 77.61,24.95 C6.1 C9.1 | C9.1 C7.1 | C9.1 EARTH4.1@0 | U3.2 61.71,40.55 62.46,41.3 62.46,41.95 C8.1 62.56,42.95 62.21,43.3 61.21,43.3 60.96,43.55 60.96,44.45 C4.1 60.96,44.65 60.96,45.3 61.21,45.55 64.21,45.55 65.01,44.75 U1.43 | PC1.- ON.C | 83.36,44 C1.1 v81.96,42.05 | U1.5 v72.41,48.81 | v75.32,51.55 75.21,51.63 CN1.GND | Y1.4 86.66,45.85 86.96,45.55 86.96,43.05 v86.71,42.8 | U2.9 73.46,30.3 U2.25 | U2.18 71.75,31.8 72.54,31.01 72.75,31.01 U2.25 | U2.11 72.46,29.8 U2.25
  Bottom 0.305: CN1.SHLD@4 77.76,52.75 78.46,52.05 78.46,50.15 C3.1 | 83.36,44 Y1.2 | Y1.4 85.31,48.3 C2.1 | U4.6 78.4,26.51 C10.1 | U4.7 U4.6 | U4.6 U4.5 U4.4
  pour Bottom: -0.45,0.57 -0.45,62.8 145.6,62.8 146.87,62.8 146.87,-0.7 -0.45,-0.7
HWB
  Bottom 0.254: U1.33 67.67,35.75 SJ1.2
N$1
  Bottom 0.254: 62.71,44.3 62.56,44.45 C4.2 63.21,44.55 63.81,43.95 U1.42
N$2
  Bottom 0.254: U1.17 81.46,41.55 82.21,40.8 84.71,40.8 85.21,41.3 85.21,41.9 C1.2
  Bottom 0.305: Y1.1 85.31,41.8 C1.2
N$3
  Bottom 0.305: U1.16 81.01,42.35 81.71,43.05 81.71,45.3 82.21,45.8 83.06,45.8 Y1.3 83.11,48.3 C2.2
N$4  (via drill 0.3)
  Top 0.254: v32.96,4.3 33.71,3.55 40.96,3.55 57.21,19.8 57.21,22.55 59.71,25.05 79.96,25.05 81.71,23.3 87.71,23.3 92.46,18.55 92.46,15.55 v106.46,6.05
  Bottom 0.254: LED_CLICK.A 117.46,55.8 120.46,55.8 arc-90 144.46,31.8 144.46,30.8 arc-90 115.96,2.3 115.46,2.3 arc-90 113.71,4.05 113.71,5.95 arc90 LED_SPACE.C v106.46,6.05 | LED_LEFT.C arc90 27.15,8.05 32.21,8.05 arc-90 32.81,7.45 LED_DOWN.A R10.2 32.71,6.05 32.71,4.55 v32.96,4.3
N$5
  Bottom 0.254: F1.1 67.21,50.8 68.21,51.8 71.38,51.8 CN1.VBUS
N$6
  Bottom 0.254: U1.6 73.21,48.8 73.46,49.05 76.46,49.05 76.71,49.3 76.71,49.9 C3.2
N$7
  Bottom 0.254: CN1.D- 72.56,51.4 72.46,51.3 69.71,51.3 69.21,50.8 69.21,50.15 R1.1
N$8
  Bottom 0.254: U1.3 R1.2
N$9
  Bottom 0.254: U1.4 71.61,48.95 72.21,49.55 72.21,49.9 R2.2
N$10
  Bottom 0.254: CN1.D+ 73.21,51.47 74.08,50.6 74.08,50.07 R2.1
N$11  (via drill 0.3)
  Top 0.254: v111.21,57.05 92.96,57.05 91.71,55.8 81.46,55.8 79.46,53.8 79.46,49.55 77.46,47.55 61.71,47.55 56.71,52.55 56.71,54.8 53.96,57.55 39.71,57.55 v38.46,58.05
  Bottom 0.254: LED_SPACE.A arc90 142.21,31.05 142.21,32.3 arc90 120.71,53.8 114.46,53.8 arc-90 113.6,54.66 LED_CLICK.C 112.21,56.05 v111.21,57.05 | LED_RIGHT.A arc116 58.21,34.3 arc90 36.96,54.55 35.71,54.55 arc-90 35.16,55.1 R12.2 arc90 35.21,56.1 35.21,56.8 | LED_UP.C 29.2,57.05 arc-90 30.21,58.05 33.96,58.05 arc-90 35.21,56.8 | v38.46,58.05 36.46,58.05 35.21,56.8
N$12
  Bottom 0.254: LED_LEFT.A arc116 3.46,31.3 arc90 28.71,6.05 LED_DOWN.C arc90 28.96,5.81 28.96,4.8 arc90 31.21,2.8 32.46,2.8 arc90 57.51,27.85 arc94 LED_RIGHT.C 55.01,29.25 arc-90 54.21,30.05 54.21,34.55 arc-90 54.96,35.3 | 54.96,35.3 55.91,35.3 R11.2 | LED_UP.A 33.06,55.7 arc90 33.46,53.55 35.21,53.55 arc-90 54.46,35.8 arc90 54.96,35.3
N$13
  Bottom 0.254: U2.10 72.96,26.9 C9.2
N$14
  pour Top (rank 6): 34.71,32.3 34.71,29.8 42.21,29.8 42.21,32.3
  pour Top (rank 6): 27.46,38.8 27.46,36.8 34.96,36.8 34.96,39.05 27.46,39.05
N$15
  pour Top (rank 6): 26.96,25.3 26.96,22.8 34.96,22.8 34.96,25.3
N$17
  Bottom 0.254: TX_LED.A 97.46,55.05 98.46,54.05 99.31,54.05 R25.1
N$18
  Bottom 0.254: R26.1 54.11,53.95 RX_LED.A
N$19
  Bottom 0.305: R27.1 67.21,52.55 67.71,53.05 67.71,54.86 ON.A
RX_LED  (via drill 0.3)
  Top 0.254: v74.8,45.99 v74.8,46 57.76,46 v51.71,52.05
  Bottom 0.254: U1.8 v74.81,45.99 v74.8,45.99 | v51.71,52.05 50.46,52.05 49.21,53.3 49.21,54.86 RX_LED.C
SCL_HV
  Bottom 0.254: U1.18 81.26,40.75 81.71,40.3 87.96,40.3 88.46,39.8 88.46,38.3 87.96,37.8 85.81,37.8 R31.1
  Bottom 0.305: R31.1 85.71,36.65 TR2.3
SCL_LV  (via drill 0.3)
  Top 0.254: v78.46,33.3 78.46,31.3 79.71,30.05 81.71,30.05 v83.96,27.8
  Bottom 0.254: U2.23 73.96,33.05 74.21,33.3 v78.46,33.3 | v83.96,27.8 86.19,27.8 U4.2
  Bottom 0.305: TR2.2 85.51,31.65 R29.1 85.61,30.65 85.96,30.3 87.46,30.3 87.96,29.8 87.96,28.3 87.46,27.8 86.23,27.8 U4.2
SDA_HV
  Bottom 0.254: U1.19 80.06,39.95 80.46,39.55 80.46,38.3 80.96,37.8 83.11,37.8
  Bottom 0.305: TR1.3 83.21,36.65 R30.1 83.11,37.8
SDA_LV
  Bottom 0.254: R28.1 81.61,31.15 83.71,29.05 U4.1 | U2.24 79.68,32.52 80.71,33.55 81.36,33.55 TR1.2
  Bottom 0.305: TR1.2 81.51,31.65 R28.1
TX_LED  (via drill 0.3)
  Top 0.254: v71.71,44.55 78.46,44.55 79.96,43.05 80.96,43.05 81.71,43.8 87.71,43.8 87.96,43.55 93.21,43.55 v93.46,43.8
  Bottom 0.254: v71.71,44.55 71.96,44.3 71.96,39.8 73.96,37.8 77.71,37.8 77.96,37.55 U1.22 | v93.46,43.8 93.46,55 TX_LED.C
VCC  (via drill 0.2, 0.3)
  Top 0.254: ISP.2 80.44,50.01 v80.44,43.96 81.01,44.29 v88.46,44.3 | v80.21,34.8 87.71,34.8 v88.96,33.55 | v89.46,37.55 89.46,38.8 88.96,39.3 v87.46,39.3 v87.46,41.3 | v64.71,48.3 71.21,48.3 71.46,48.05 72.96,48.05 73.35,48.43 v74,48.43
  Bottom 0.254: U3.3 62.66,38.75 | 62.66,38.75 62.46,38.55 60.96,38.55 60.71,38.8 60.71,39.8 U3.1 60.76,41.95 C8.2 59.96,42.05 59.21,42.8 59.21,45.55 60.21,46.55 PC1.+ | 135.71,30.3 137.96,30.3 139.21,31.55 139.21,37.55 137.71,39.05 130.46,39.05 129.71,39.8 R22.2 126.46,41.05 120.46,47.05 119.31,47.05 R9.2 119.21,50.55 117.71,52.05 112.71,52.05 108.86,55.9 99.96,55.9 | 135.71,30.3 135.31,30.3 R23.2 | 135.71,30.3 135.21,29.8 135.21,24.05 134.46,23.3 130.46,23.3 129.76,22.6 R20.2 120.71,21.05 119.21,19.55 R8.2 | R24.2 95.21,23.8 97.96,21.05 R19.2 99.21,21.2 99.21,22.8 103.71,27.3 103.71,35.3 101.06,37.95 R21.2 102.96,41.05 105.46,43.55 105.46,50.4 99.96,55.9 | 35.71,43.8 38.81,40.7 R18.2 47.31,38.2 48.21,37.3 51.96,37.3 53.21,36.05 53.21,26.8 52.21,25.8 47.41,25.8 R7.2 R17.2 | 35.71,43.8 R4.2 | 47.21,21.3 R17.2 | R13.2 R5.2 11.56,25.7 9.46,27.8 9.46,38.55 11.71,40.8 11.96,40.8 | 11.96,40.8 14.71,40.8 R14.2 32.61,40.7 35.71,43.8 | R3.2 91.36,52.2 91.71,52.55 91.71,55.55 | 91.71,55.55 91.71,56.05 92.71,57.05 98.31,57.05 R25.2 99.96,55.9 | PC1.+ 58.46,50.05 57.71,50.8 57.71,55.05 56.96,55.8 55.61,55.8 R26.2 55.46,56.55 54.71,57.3 42.21,57.3 39.71,59.8 22.96,59.8 11.46,48.3 11.46,41.3 11.96,40.8 | ISP.2 82.2,52.04 83.21,53.05 85.46,53.05 86.01,53.6 86.01,55.36 86.71,56.05 91.21,56.05 91.71,55.55 | U1.34 64.71,37.55 63.46,38.8 62.71,38.8 62.66,38.75 | PC1.+ F1.2 64.21,48.8 v64.71,48.3 | v80.44,43.96 v80.43,43.95 U1.14 74.48,43.94 74.01,44.41 U1.7 v74,48.43 | U1.24 76.41,34.6 76.96,34.05 79.46,34.05 v80.21,34.8 | v88.96,33.55 88.96,37.05 v89.46,37.55 | v87.46,39.3 85.81,39.3 R31.2
  Bottom 0.254: R6.2 43.26,14 44.46,12.8 48.21,12.8 49.46,14.05 49.46,20.55 48.71,21.3 47.41,21.3 R17.2 | U1.44 67.41,45.6 v64.71,48.3 | U1.2 70.01,48.5 69.71,48.8 68.46,48.8 67.96,48.3 v64.71,48.3 | v87.46,41.3 88.21,41.3 88.46,41.55 v88.46,44.3
  Bottom 0.305: F1.2 64.21,51.9 R27.2 | R30.2 R31.2

### Text on the board
bPlace: ShakeUp | WebUSB | Manufactured in Australia | USB device for the WEB | by | Little Bird Co | Version 1.1 | SKU : LB-SHAKEUP-1 | EARTH | EARTH | JLCJLCJLCJLC
tRestrict: UP | LEFT | RIGHT | DOWN